# EAGLE design main (EAGLE 6.1)
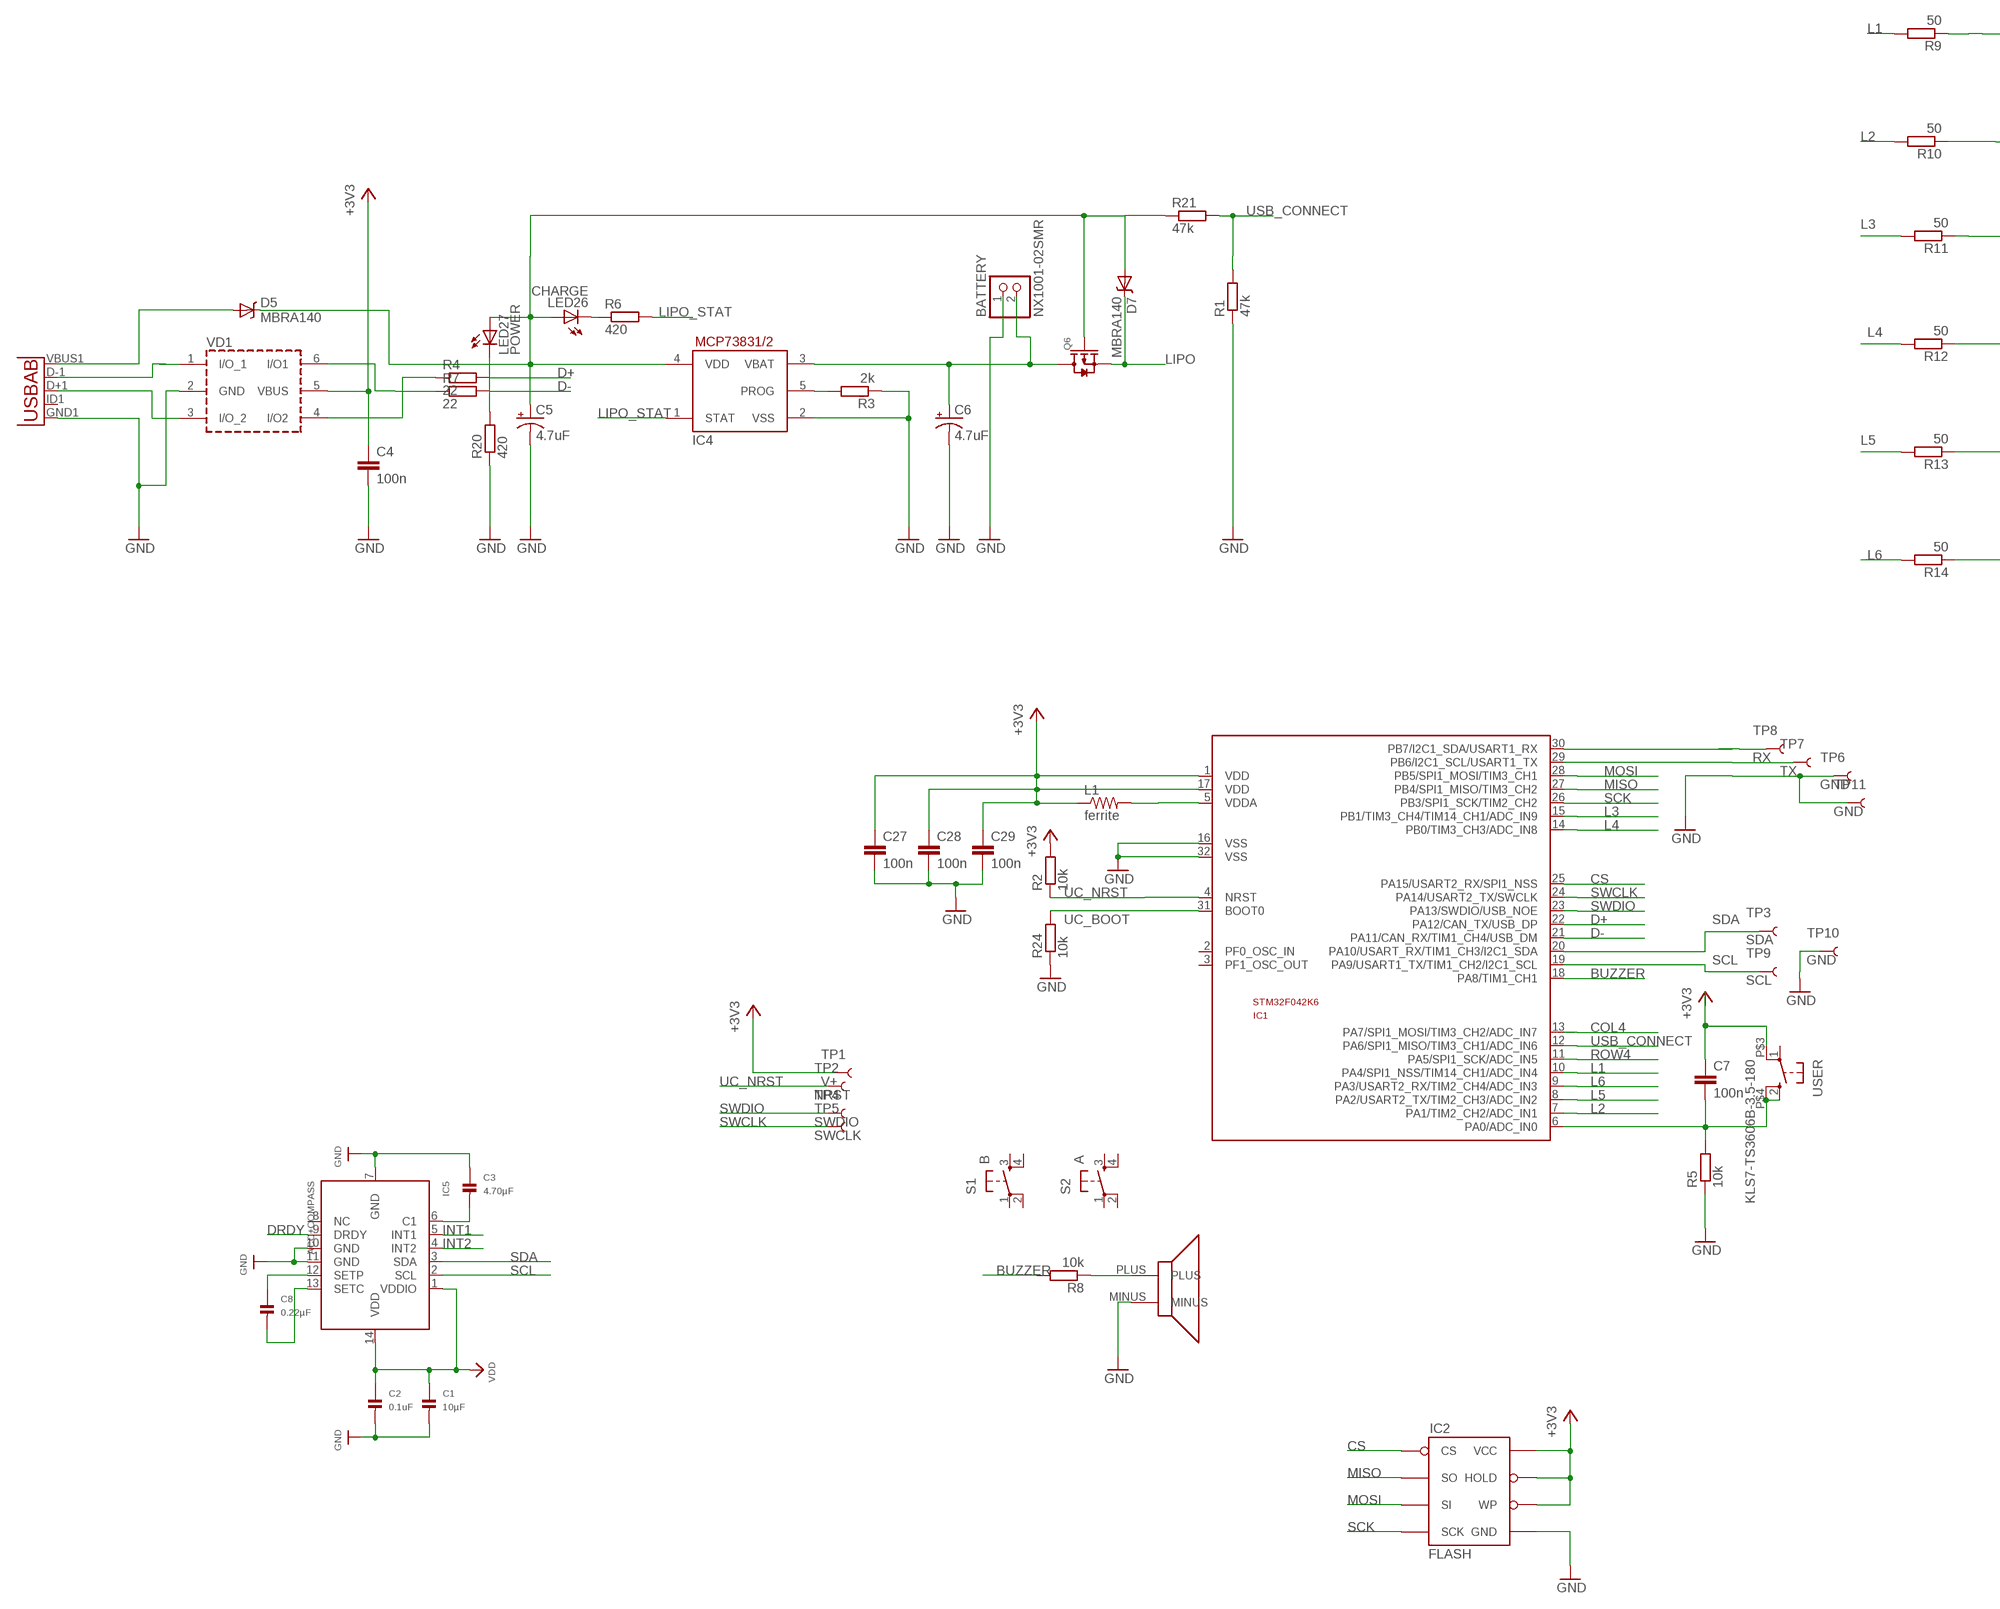
[diagram p0: schematic, sheet 1, part 1 of 2]
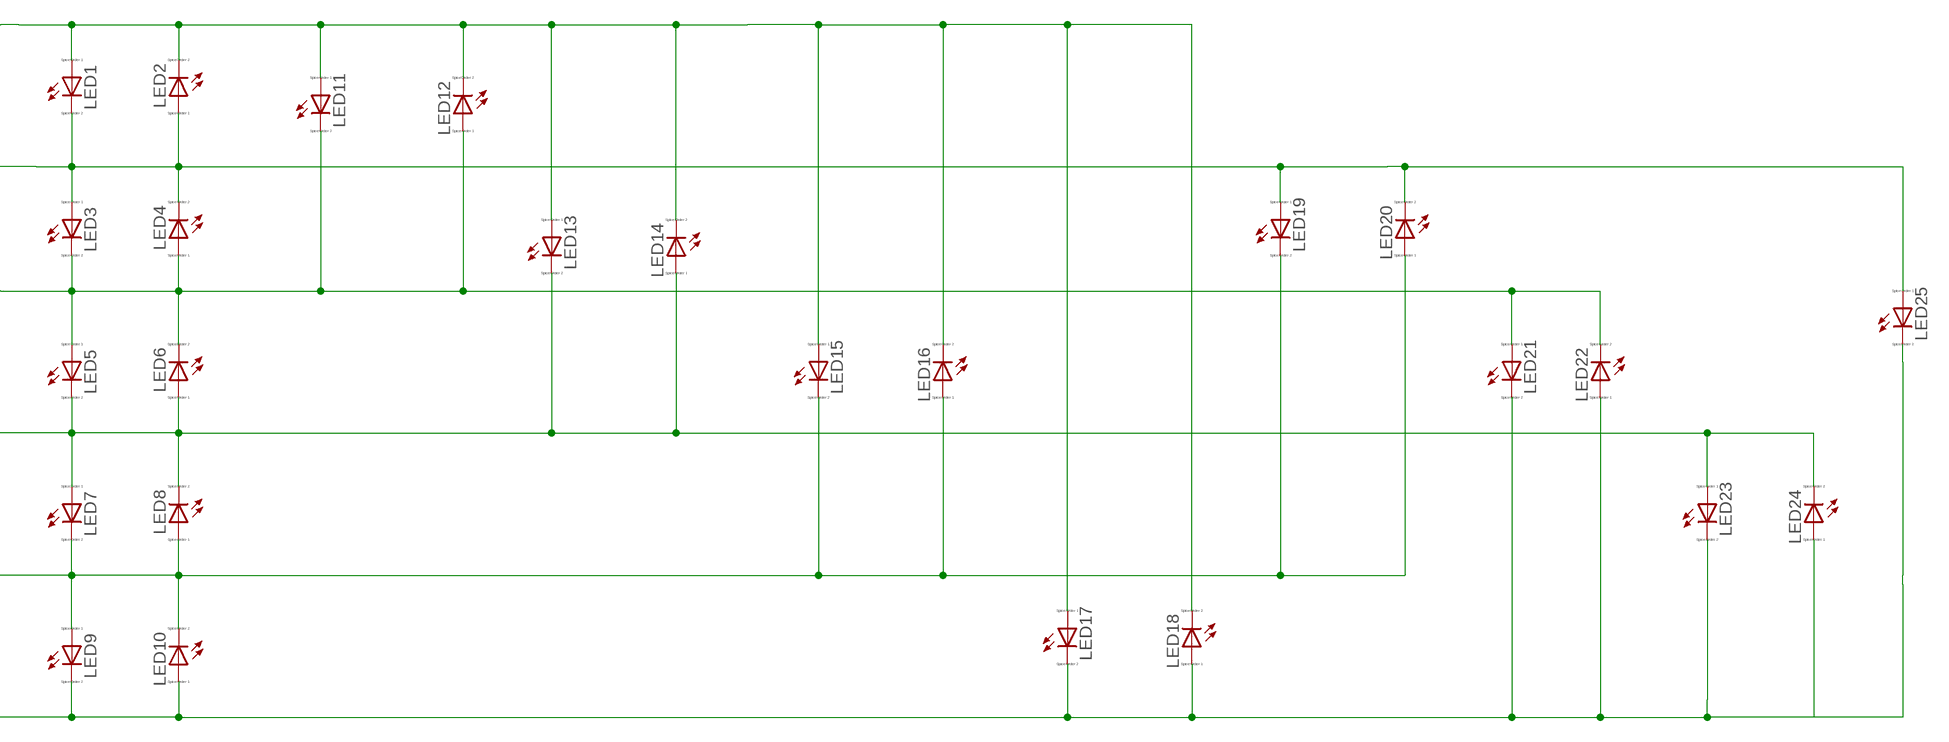
[diagram p1: schematic, sheet 1, part 2 of 2]

## Parts
BATTERY  NX1001-02SMR  [NX1001-02]
C1  10µF  CAP_CERAMIC_0805  [_0805]
C2  0.1uF  CAP_CERAMIC_0805  [_0805]
C3  4.70µF  CAP_CERAMIC_0805  [_0805]
C4  100n  C-EUC0603  [C0603]
C5  4.7uF  CAP_POL1206  [EIA3216]
C6  4.7uF  CAP_POL1206  [EIA3216]
C7  100n  C-EUC0603  [C0603]
C8  0.22µF  CAP_CERAMIC_0805  [_0805]
C27  100n  C-EUC0603  [C0603]
C28  100n  C-EUC0603  [C0603]
C29  100n  C-EUC0603  [C0603]
D5  MBRA140  [SMA-DIODE]
D7  MBRA140  [SMA-DIODE]
IC1  STM32F042K6  [LQFP32-7X7]
IC2  FLASH  AT25DF041A-SSH-T  [SO08]
IC4  MCP73831  MCP73831/OT  [SOT23-5L]
IC5  ACC+COMPASS  LSM303DLHC  [LGA14]
L1  ferrite  220-5%  [0603-RES]
LED1  LED_ESML0603  [LED_SML0603]
LED2  LED_ESML0603  [LED_SML0603]
LED3  LED_ESML0603  [LED_SML0603]
LED4  LED_ESML0603  [LED_SML0603]
LED5  LED_ESML0603  [LED_SML0603]
LED6  LED_ESML0603  [LED_SML0603]
LED7  LED_ESML0603  [LED_SML0603]
LED8  LED_ESML0603  [LED_SML0603]
LED9  LED_ESML0603  [LED_SML0603]
LED10  LED_ESML0603  [LED_SML0603]
LED11  LED_ESML0603  [LED_SML0603]
LED12  LED_ESML0603  [LED_SML0603]
LED13  LED_ESML0603  [LED_SML0603]
LED14  LED_ESML0603  [LED_SML0603]
LED15  LED_ESML0603  [LED_SML0603]
LED16  LED_ESML0603  [LED_SML0603]
LED17  LED_ESML0603  [LED_SML0603]
LED18  LED_ESML0603  [LED_SML0603]
LED19  LED_ESML0603  [LED_SML0603]
LED20  LED_ESML0603  [LED_SML0603]
LED21  LED_ESML0603  [LED_SML0603]
LED22  LED_ESML0603  [LED_SML0603]
LED23  LED_ESML0603  [LED_SML0603]
LED24  LED_ESML0603  [LED_SML0603]
LED25  LED_ESML0603  [LED_SML0603]
LED26  CHARGE  LEDCHIP-LED0805  [CHIP-LED0805]
LED27  POWER  LEDCHIP-LED0805  [CHIP-LED0805]
Q6  MOSFET-P-044021001  [SOT23]
R1  47k  R-EU_R0603  [R0603]
R2  10k  R-EU_R0603  [R0603]
R3  2k  R-EU_R0603  [R0603]
R4  22  R-EU_R0603  [R0603]
R5  10k  R-EU_R0603  [R0603]
R6  420  R-EU_R0603  [R0603]
R7  22  R-EU_R0603  [R0603]
R8  10k  R-EU_R0603  [R0603]
R9  50  R-EU_R0603  [R0603]
R10  50  R-EU_R0603  [R0603]
R11  50  R-EU_R0603  [R0603]
R12  50  R-EU_R0603  [R0603]
R13  50  R-EU_R0603  [R0603]
R14  50  R-EU_R0603  [R0603]
R20  420  R-EU_R0603  [R0603]
R21  47k  R-EU_R0603  [R0603]
R24  10k  R-EU_R0603  [R0603]
S1  B  DTSM-6  [DTSM-6]
S2  A  DTSM-6  [DTSM-6]
TP1  V+  TEST-POINT3X5  [PAD.03X.05]
TP2  NRST  TEST-POINT3X5  [PAD.03X.05]
TP3  SDA  TEST-POINT3X5  [PAD.03X.05]
TP4  SWDIO  TEST-POINT3X5  [PAD.03X.05]
TP5  SWCLK  TEST-POINT3X5  [PAD.03X.05]
TP6  GND  TEST-POINT3X5  [PAD.03X.05]
TP7  TX  TEST-POINT3X5  [PAD.03X.05]
TP8  RX  TEST-POINT3X5  [PAD.03X.05]
TP9  SCL  TEST-POINT3X5  [PAD.03X.05]
TP10  GND  TEST-POINT3X5  [PAD.03X.05]
TP11  GND  TEST-POINT3X5  [PAD.03X.05]
U2  USB""  [USB-MICRO-SMD]
U$1  SMD-090045F-03627  [SMD090045F]
USER  KLS7-TS3606B-3.5-180  [KLS7-TS3606B]
VD1  USBLC6-2SC6  [SOT-23-6L]

## Nets
+3V3: C4.1 C7.1 C27.1 C28.1 C29.1 IC1.1(VDD) IC1.17(VDD) IC2.3(WP) IC2.7(HOLD) IC2.8(VCC) L1.1 R2.2 TP1.P$1 USER.P$3 VD1.5(VBUS)
BBBB: BATTERY.2 C6.A(+) IC4.3(VBAT) Q6.3(D)
BUZZER: IC1.18(PA8/TIM1_CH1) R8.2
COL4: IC1.13(PA7/SPI1_MOSI/TIM3_CH2/ADC_IN7)
CS: IC1.25(PA15/USART2_RX/SPI1_NSS) IC2.1(CS)
D+: IC1.22(PA12/CAN_TX/USB_DP) R4.2
D-: IC1.21(PA11/CAN_RX/TIM1_CH4/USB_DM) R7.2
DRDY: IC5.9(DRDY)
GND: BATTERY.1 C1.2 C2.2 C3.1 C4.2 C5.C(-) C6.C(-) C27.2 C28.2 C29.2 IC1.16(VSS) IC1.32(VSS) IC2.4(GND) IC4.2(VSS) IC5.7(GND) IC5.10(GND) IC5.11(GND) R1.1 R3.1 R5.1 R20.1 R24.1 TP6.P$1 TP10.P$1 TP11.P$1 U2.GND1(GND) U$1.MINUS VD1.2(GND)
INT1: IC5.5(INT1)
INT2: IC5.4(INT2)
L1: IC1.10(PA4/SPI1_NSS/TIM14_CH1/ADC_IN4) R9.2
L2: IC1.7(PA1/TIM2_CH2/ADC_IN1) R10.2
L3: IC1.15(PB1/TIM3_CH4/TIM14_CH1/ADC_IN9) R11.2
L4: IC1.14(PB0/TIM3_CH3/ADC_IN8) R12.2
L5: IC1.8(PA2/USART2_TX/TIM2_CH3/ADC_IN2) R13.2
L6: IC1.9(PA3/USART2_RX/TIM2_CH4/ADC_IN3) R14.2
LIPO: D7.C Q6.2(S)
LIPO_STAT: IC4.1(STAT) R6.2
MISO: IC1.27(PB4/SPI1_MISO/TIM3_CH2) IC2.2(SO)
MOSI: IC1.28(PB5/SPI1_MOSI/TIM3_CH1) IC2.5(SI)
N$1: R8.1 U$1.PLUS
N$2: U2.D-1(D-) VD1.1(I/O_1)
N$3: U2.D+1(D+) VD1.3(I/O_2)
N$4: C3.2 IC5.6(C1)
N$5: C8.1 IC5.12(SETP)
N$6: C8.2 IC5.13(SETC)
N$7: IC4.5(PROG) R3.2
N$8: LED1.A LED2.C LED11.A LED12.C LED13.A LED14.C LED15.A LED16.C LED17.A LED18.C R9.1
N$9: LED1.C LED2.A LED3.A LED4.C LED19.A LED20.C LED25.A R10.1
N$12: LED3.C LED4.A LED5.A LED6.C LED11.C LED12.A LED21.A LED22.C R11.1
N$13: D5.A U2.VBUS1(VBUS)
N$14: IC1.29(PB6/I2C1_SCL/USART1_TX) TP7.P$1
N$15: IC1.5(VDDA) L1.2
N$16: R7.1 VD1.6(I/O1)
N$17: LED26.C R6.1
N$19: LED5.C LED6.A LED7.A LED8.C LED13.C LED14.A LED23.A LED24.C R12.1
N$21: R4.1 VD1.4(I/O2)
N$23: LED7.C LED8.A LED9.A LED10.C LED15.C LED16.A LED19.C LED20.A R13.1
N$24: LED27.C R20.2
N$26: LED9.C LED10.A LED17.C LED18.A LED21.C LED22.A LED23.C LED24.A LED25.C R14.1
N$27: C5.A(+) D5.C D7.A IC4.4(VDD) LED26.A LED27.A Q6.1(G) R21.1
ROW4: IC1.11(PA5/SPI1_SCK/ADC_IN5)
RX: IC1.30(PB7/I2C1_SDA/USART1_RX) TP8.P$1
SCK: IC1.26(PB3/SPI1_SCK/TIM2_CH2) IC2.6(SCK)
SCL: IC1.19(PA9/USART1_TX/TIM1_CH2/I2C1_SCL) IC5.2(SCL) TP9.P$1
SDA: IC1.20(PA10/USART_RX/TIM1_CH3/I2C1_SDA) IC5.3(SDA) TP3.P$1
SWCLK: IC1.24(PA14/USART2_TX/SWCLK) TP5.P$1
SWDIO: IC1.23(PA13/SWDIO/USB_NOE) TP4.P$1
UC_BOOT: IC1.31(BOOT0) R24.2
UC_NRST: IC1.4(NRST) R2.1 TP2.P$1
USB_CONNECT: IC1.12(PA6/SPI1_MISO/TIM3_CH1/ADC_IN6) R1.2 R21.2
VDD: C1.1 C2.1 IC5.1(VDDIO) IC5.14(VDD)
WAKE_UP: C7.2 IC1.6(PA0/ADC_IN0) R5.2 USER.2 USER.P$4
Unconnected: IC1.2(PF0_OSC_IN) IC1.3(PF1_OSC_OUT) IC5.8(NC) S1.1 S1.2 S1.3 S1.4 S2.1 S2.2 S2.3 S2.4 U2.ID1(USBID) USER.1

## Library data of the parts
BATTERY = connectors:NX1001-02SMR
C1-C3 C8 = microbuilder:CAP_CERAMIC: Ceramic Capacitors 0402 - 0402 Surface Mount Capacitors 16pF 50V 5% [Digikey: 445-4899-2-ND] 18pF 50V 5% [Digikey: 490-1281-2-ND] 22pF 50V 5% [Digikey: 490-1283-2-ND] 68pF 50V 5% [Digikey: 490-1289-2-ND] 0.1uF 10V 10% [Digikey: 490-1318-2-ND] 1.0uF 6.3V 10% [Digikey: 490-1320-2-ND] 0603 - 0603 Surface Mount Capacitors 16 pF 50V 5% [Digikey: 445-5051-2-ND] 22 pF 50V [Digikey: PCC220ACVTR-ND] 33 pF 50V 5% [Digikey: 490-1415-1-ND] 56pF 50V 5% [Digikey: 490-1421-1-ND] 220pF 50V 5% [Digikey: 445-1285-1-ND] 680 pF 50V 2200 pF 50V 5% C0G [Digikey: 445-1297-1-ND] 5600 pF 100V 5% X7R [Digikey: 478-3711-1-ND] 0.1 µF 25V 10% [Digikey: PCC2277TR-ND] 0.22 µF 16V 10% X7R [Digikey: 445-1318-1-ND] 1.0 µF 25V 10% [Digikey: 445-5146-2-ND] 0603 - RF Specific 3pF 250V +/-0.1pF RF [Digikey: 712-1347-1-ND] 18 pF 250V 5% [Digikey: 478-3505-1-ND or 712-1322-1-ND] 56 pF 250V 5% C0G RF [Digikey: 490-4867-1-ND] 68 pF 250V RF [Digikey: 490-4868-1-ND] 0805 - 0805 Surface Mount Capacitors 220 pF 250V 2% RF Ceramic Capacitor [Digikey: 712-1398-1-ND] 1000 pF 50V 2% NP0 Ceramic Capacitor [Digikey: 478-3760-1-ND] 0.1 µF 25V 10% Ceramic Capacitor [Digikey: PCC1828TR-ND] 1.0 µF 16V 10% Ceramic Capacitor[Digikey: 490-1691-2-ND] 10.0 µF 10V 10% Ceramic Capacitor[Digikey: 709-1228-1-ND] 10.0 uF 16V 10% Ceramic Capacitor [Digikey: 478-5165-2-ND] 47 uF 6.3V 20% Ceramic Capacitor [Digikey: 587-1779-1-ND or 399-5506-1-ND] 1206 - 1206 Surface Mount Capacitors 47uF 10V 20% Ceramic Capacitor [Digikey: 490-5528-1-ND or 399-5508-1-ND or 445-6010-1-ND] 100uF 6.3V -20%, +80% Y5V Ceramic Capacitor (Digikey: 490-4512-1-ND, Mouser: 81-GRM31CF50J107ZE1L)
C4 C7 C27-C29 = resistor:C-EU: CAPACITOR, European symbol
C5 C6 = SparkFun-Passives:CAP_POL: Capacitor Polarized These are standard SMD and PTH capacitors. Normally 10uF, 47uF, and 100uF in electrolytic and tantalum varieties. Always verify the external diameter of the through hole cap, it varies with capacity, voltage, and manufacturer. The EIA devices should be standard.
D5 D7 = SparkFun-DiscreteSemi:MBRA140: 40V, 1A Schottky rectifier SMA/DO-214AC package DIO-08053; PROD_ID: DIO-08053
IC1 = guh:STM32F042K6: STM32F042K6
IC2 = SparkFun-DigitalIC:AT25DF041A-SSH-T
IC4 = adafruit:MCP73831: MCP73831/2 Miniature Single-Cell, Fully Integrated Li-Ion, Li-Polymer Charge Management Controllers. Nice and small simple lipoly charge controller, with adjustable current and status output (LED) http://www.ladyada.net/library/pcb/eaglelibrary.html
IC5 = microbuilder:LSM303DLHC: LSM303DLHC 3-Axis I2C Accelerometer and 3-Axis Magnetometer VDD: 2.2-3.6V VDDIO: 1.8-VDD Magnetic Range: +/-1.3 to +/-8.1 gauss Accel Range: +/-2/4/8/16 g Temp: -40 - 85°C
L1 = SparkFun-Resistors:220-5%: 220-ohm SMT 1/8W - 5% (0805) RES-07866; PROD_ID: RES-07866; VALUE: 220
LED1-LED25 = eagle-ltspice:LED_E: LED Source: http://www.osram.convergy.de Source: www.luxeon.com Source: www.kingbright.com; SPICEMODEL: NONE; SPICEPREFIX: D; SPICETYPE: diode
LED26 LED27 = adafruit:LED: LED OSRAM: - CHIPLED LG R971, LG N971, LY N971, LG Q971, LY Q971, LO R971, LY R971 LH N974, LH R974 LS Q976, LO Q976, LY Q976 LO Q996 - Hyper CHIPLED LW Q18S LB Q993, LB Q99A, LB R99A - SideLED LS A670, LO A670, LY A670, LG A670, LP A670 LB A673, LV A673, LT A673, LW A673 LH A674 LY A675 LS A676, LA A676, LO A676, LY A676, LW A676 LS A679, LY A679, LG A679 - Hyper Micro SIDELED® LS Y876, LA Y876, LO Y876, LY Y876 LT Y87S - SmartLED LW L88C, LW L88S LB L89C, LB L89S, LG L890 LS L89K, LO L89K, LY L89K LS L896, LA L896, LO L896, LY L896 - TOPLED LS T670, LO T670, LY T670, LG T670, LP T670 LSG T670, LSP T670, LSY T670, LOP T670, LYG T670 LG T671, LOG T671, LSG T671 LB T673, LV T673, LT T673, LW T673 LH T674 LS T676, LA T676, LO T676, LY T676, LB T676, LH T676, LSB T676, LW T676 LB T67C, LV T67C, LT T67C, LS T67K, LO T67K, LY T67K, LW E67C LS E67B, LA E67B, LO E67B, LY E67B, LB E67C, LV E67C, LT E67C LW T67C LS T679, LY T679, LG T679 LS T770, LO T770, LY T770, LG T770, LP T770 LB T773, LV T773, LT T773, LW T773 LH T774 LS E675, LA E675, LY E675, LS T675 LS T776, LA T776, LO T776, LY T776, LB T776 LHGB T686 LT T68C, LB T68C - Hyper Mini TOPLED® LB M676 - Mini TOPLED Santana® LG M470 LS M47K, LO M47K, LY M47K Source: http://www.osram.convergy.de/
Q6 = OPL Eagle Library:MOSFET-P: CJ2305：SMD MOSFET P-CH 8V-4.1A
R1-R14 R20 R21 R24 = resistor:R-EU_: RESISTOR, European symbol
S1 S2 = switch-tact:DTSM-6
TP1-TP11 = SparkFun-Passives:TEST-POINT: Bare copper test points for troubleshooting or ICT
U2 = MicroUSB:USB: This is a USB AB connector that is compatible with USB OTG. i.e. this connector can serve as a host or device
U$1 = Elements:SMD-090045F-03627
USER = connectors:KLS7-TS3606B-3.5-180
VD1 = usblc6:USBLC6-2: VERY LOW CAPACITANCE ESD PROTECTION 2 line Datasheet link <http://www.st.com/web/catalog/sense_power/FM114/CL1137/SC1489/PF93353>

## Net classes
2 gnd: width 0.305 mm, drill 0.559 mm, clearance 0.254 mm

## Board
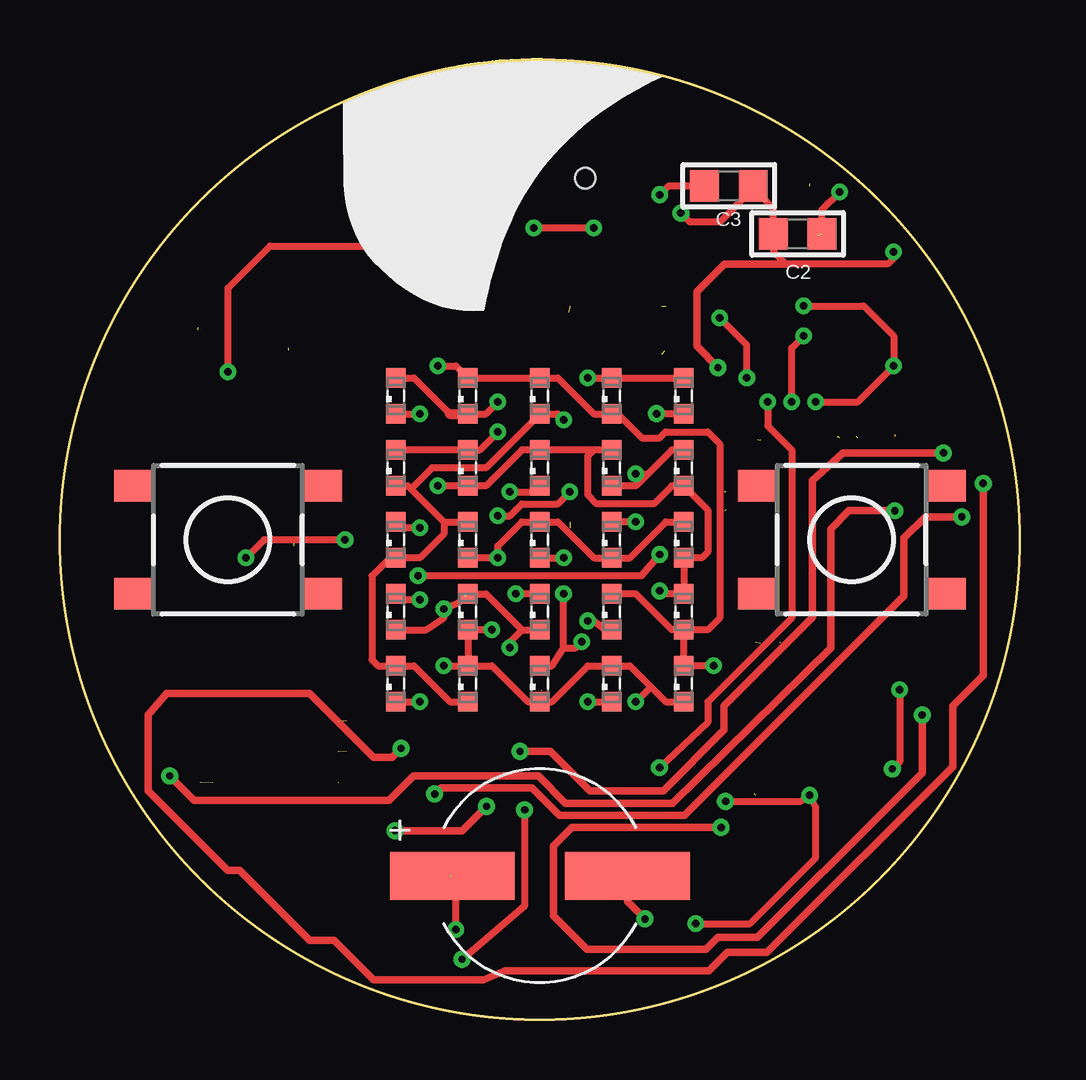
[diagram p2: board, top side]
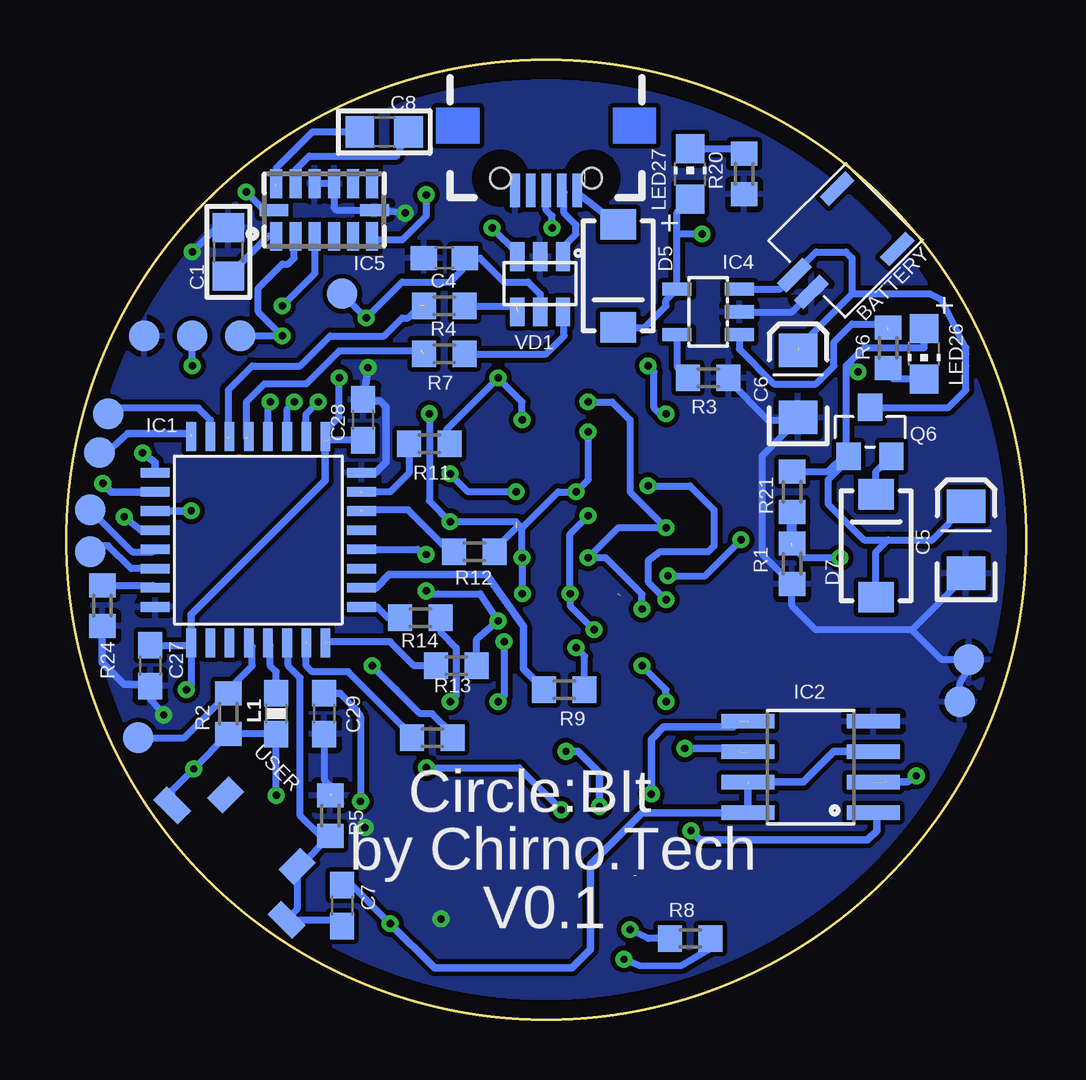
[diagram p3: board, bottom side, seen from below]

Size 40 x 40 mm. Coordinates in mm from the lower left corner, seen from the top.
Outline: circle at 20,20 radius 20
Copper layers (1*16): Top 0.035mm / dielectric 1.5mm / Bottom 0.035mm
Design rules: minimum track width 0.2mm, minimum drill 0.3mm, track to track 0.2mm, track to pad 0.2mm, pad to pad 0.2mm, via to via 0.2mm, smd to smd 8mil, copper to edge 30mil, drill to drill 8mil, minimum pad ring 10mil, minimum via ring 8mil, stop-mask expansion 4mil, vias tented up to drill 0.4mm, thermal gap 10mil

### Footprints (pad centres in the part's own frame; a part is rotated, then mirrored left to right if it is on the bottom)
NX1001-02 = smd 0.55 x 1.5: 1 -0.508,0.25; 2 0.492,0.25; P$3 -1.778,-3.56; P$4 1.778,-3.56
_0805 = smd 1.2 x 1.3: 1 -1.016,0; 2 1.016,0
C0603 = smd 1.1 x 1: 1 -0.85,0; 2 0.85,0
EIA3216 = smd 1.4 x 1.6: A 1.4,0; C -1.4,0
SMA-DIODE = smd 1.27 x 1.47: A -2.15,0; C 2.15,0
LQFP32-7X7 = smd 1.2 x 0.4: 1 -4.3,2.8; 2 -4.3,2; 3 -4.3,1.2; 4 -4.3,0.4; 5 -4.3,-0.4; 6 -4.3,-1.2; 7 -4.3,-2; 8 -4.3,-2.8; 17 4.3,-2.8; 18 4.3,-2; 19 4.3,-1.2; 20 4.3,-0.4; 21 4.3,0.4; 22 4.3,1.2; 23 4.3,2; 24 4.3,2.8 | smd 0.4 x 1.2: 9 -2.8,-4.3; 10 -2,-4.3; 11 -1.2,-4.3; 12 -0.4,-4.3; 13 0.4,-4.3; 14 1.2,-4.3; 15 2,-4.3; 16 2.8,-4.3; 25 2.8,4.3; 26 2,4.3; 27 1.2,4.3; 28 0.4,4.3; 29 -0.4,4.3; 30 -1.2,4.3; 31 -2,4.3; 32 -2.8,4.3
SO08 = smd 0.61 x 2.21: 1 -1.905,-2.616; 2 -0.635,-2.616; 3 0.635,-2.616; 4 1.905,-2.616; 5 1.905,2.616; 6 0.635,2.616; 7 -0.635,2.616; 8 -1.905,2.616
SOT23-5L = smd 0.55 x 1.2: 1 -0.95,-1.3; 2 0,-1.3; 3 0.95,-1.3; 4 0.95,1.3; 5 -0.95,1.3
LGA14 = smd 0.5 x 1.2: 1 2,1.1; 2 1.2,1.1; 3 0.4,1.1; 4 -0.4,1.1; 5 -1.2,1.1; 6 -2,1.1; 8 -2,-1.1; 9 -1.2,-1.1; 10 -0.4,-1.1; 11 0.4,-1.1; 12 1.2,-1.1; 13 2,-1.1 | smd 1.2 x 0.5: 7 -2.1,0; 14 2.1,0
0603-RES = smd 1.1 x 1: 1 -0.85,0; 2 0.85,0
LED_SML0603 = smd 0.8 x 0.8: A 0.75,0; C -0.75,0
CHIP-LED0805 = smd 1.2 x 1.2: A 0,-1.05; C 0,1.05
SOT23 = smd 1.016 x 1.143: 1 -0.889,-1.016; 2 0.889,-1.016; 3 0,1.016
R0603 = smd 1 x 1.1: 1 -0.85,0; 2 0.85,0
DTSM-6 = smd 1.55 x 1.3: 1 -3.975,2.25; 2 3.975,2.25; 3 -3.975,-2.25; 4 3.975,-2.25
PAD.03X.05 = smd 1.27 x 1.27: P$1 0,0
USB-MICRO-SMD = smd 1.4 x 0.4: D+1 2.7,0; D-1 2.7,0.65; GND1 2.7,-1.3; ID1 2.7,-0.65; VBUS1 2.7,1.3 | hole 0.85: 2.2,1.9; 2.2,-1.9
SMD090045F = smd 5.2 x 2: MINUS 3.65,0; PLUS -3.65,0
KLS7-TS3606B = smd 0.9 x 1.27: 1 -2.1,0.885; 2 2.1,0.885 | smd 1.45 x 0.8: P$3 -3.375,-1; P$4 3.375,-1
SOT-23-6L = smd 0.6 x 1.2: 1 -0.95,-2.3; 2 0,-2.3; 3 0.95,-2.3; 4 0.95,0; 5 0,0; 6 -0.95,0

### Placement (x,y rotation side)
BATTERY  9.13,30.87 135 bottom
C1  33.25,32 90 bottom
C2  30.75,32.75 180 top
C3  27.88,34.75 180 top
C4  24.25,31.75 180 bottom
C5  2.5,20 90 bottom
C6  9.5,26.5 90 bottom
C7  28.5,4.75 270 bottom
C8  26.75,37 180 bottom
C27  36.5,14.75 270 bottom
C28  27.63,25 90 bottom
C29  29.25,12.75 270 bottom
D5  17,31 270 bottom
D7  6.25,19.75 90 bottom
IC1  32,20 90 bottom
IC2  8.97,10.53 90 bottom
IC4  13.25,29.5 90 bottom
IC5  29.25,33.75 180 bottom
L1  31.25,12.75 90 bottom
LED1  14,26 90 top
LED2  17,26 90 top
LED3  20,26 90 top
LED4  23,26 90 top
LED5  26,26 90 top
LED6  14,23 90 top
LED7  17,23 90 top
LED8  20,23 90 top
LED9  23,23 90 top
LED10  26,23 90 top
LED11  14,20 90 top
LED12  17,20 90 top
LED13  20,20 90 top
LED14  23,20 90 top
LED15  26,20 90 top
LED16  14,17 90 top
LED17  17,17 90 top
LED18  20,17 90 top
LED19  23,17 90 top
LED20  26,17 90 top
LED21  14,14 90 top
LED22  17,14 90 top
LED23  20,14 90 top
LED24  23,14 90 top
LED25  26,14 90 top
LED26  4.25,27.75 180 bottom
LED27  14,35.25 0 bottom
Q6  6.5,24.5 0 bottom
R1  9.75,19 90 bottom
R2  33.25,12.75 270 bottom
R3  13.25,26.75 180 bottom
R4  24.25,29.75 180 bottom
R5  29,8.5 270 bottom
R6  5.75,28 90 bottom
R7  24.25,27.75 180 bottom
R8  14,3.38 0 bottom
R9  19.25,13.75 180 bottom
R10  24.75,11.75 180 bottom
R11  24.87,24 180 bottom
R12  23,19.5 180 bottom
R13  23.75,14.75 180 bottom
R14  25.25,16.75 180 bottom
R20  11.75,35.25 90 bottom
R21  9.75,22 270 bottom
R24  38.5,17.25 90 bottom
S1  33,20 0 top
S2  7,20 0 top
TP1  28.5,30.25 0 bottom
TP2  37,11.75 0 bottom
TP3  34.75,28.5 0 bottom
TP4  38.25,25.25 0 bottom
TP5  38.62,23.63 0 bottom
TP6  2.38,15 0 bottom
TP7  39,21.25 0 bottom
TP8  39,19.5 0 bottom
TP9  32.75,28.5 0 bottom
TP10  36.75,28.5 0 bottom
TP11  2.75,13.25 0 bottom
U2  20,37.27 270 bottom
U$1  20,6 0 top
USER  32.5,7.25 315 bottom
VD1  20.25,29.5 180 bottom

### Tracks (layer width: path | path; a pad name or v marks a point on that pad's centre or on a via)
+3V3  (via drill 0.3)  (2 unrouted)
  Top 0.3: v35,13.75 35,10.75 v34.7,10.45 | v28.63,26.75 28.63,28.12 v27.5,29.25 | v26.5,4 28.75,4 31.5,6.75 31.5,8.85 v31.25,9.35 30.87,9.1 v27.75,9.1
  Bottom 0.3: C28.1 29.1,24.15 29.25,24.25 29.25,24.5 28.63,25.12 v28.63,26.75 | C27.1 34.9,15.6 IC1.1 34.8,13.95 v35,13.75 | USER.P$3 35.59,9.56 34.83,10.32 v34.7,10.45 R2.2 L1.1 | TP1.P$1 v27.5,29.25 26,30.75 24,30.75 23.5,31.25 23.5,31.65 C4.1 22.75,31.75 21.75,30.75 20.75,30.75 20.25,30.25 VD1.5 | C7.1 28.1,5.6 v26.5,4 | v31.25,9.35 L1.1 | L1.1 31.25,12 | C29.1 28.9,13.6 28.6,13.6 28,13 27.75,12.64 v27.75,9.1
  Bottom 0.305: 29.1,24.15 IC1.17 | 34.83,10.32 v34.7,10.45 | C29.1 28.9,13.6 | 28.9,13.6 28.6,13.6 28.9,13.6 | IC1.1 34.8,16.89 29.21,22.48 29.21,24.13 | v26.5,4 24.66,2.16 18.92,2.16 18.16,2.92 18.16,6.48 16.02,8.62 IC2.8 11.59,9.88 11.56,9.91 9.27,9.91 8,11.18 6.37,11.18 IC2.3
BBBB  (1 unrouted)
  Bottom 0.3: IC4.3 10.25,30.45 BATTERY.2 9.66,31.09 8.75,32 7.5,32 7.25,31.75 7.25,30.25 | Q6.3 3.23,25.52 2.5,26.25 2.5,27.25 2.5,27.75 2.5,28 3.5,30 4,30.25 7.25,30.25 | 7.25,30.25 8.25,29.25 9.5,28
BUZZER  (via drill 0.3)
  Top 0.3: v29.5,25.75 29.5,24.75 30.5,23.75 30.5,16.75 27,13.25 27,12.38 v25,10.5 | v19.37,8.74 19.37,4.75 v16.76,2.52
  Bottom 0.3: IC1.18 30,25.25 v29.5,25.75 | v25,10.5 21.13,10.5 v19.37,8.74 | v16.76,2.52 16.16,2.26 14.39,2.25 13.25,2.9 R8.2
CS  (via drill 0.3)
  Top 0.305: v36.83,23.62 32.64,23.62 31.37,22.48 31.37,16.76 27.69,13.08 27.69,12.06 25.15,9.53 22.1,9.53 20.45,11.18 v19.18,11.18 | v13.97,7.87 16.76,7.87 v17.78,8.89
  Bottom 0.305: IC1.25 36.3,23.22 v36.83,23.62 | IC2.1 6.22,8.49 6.22,7.87 6.6,7.49 13.59,7.49 v13.97,7.87 | v17.78,8.89 17.78,10.29 18.67,11.18 v19.18,11.18
D+  (2 unrouted)
  Bottom 0.3: 33.25,24.25 33.25,25.25 33.25,26.25 32.25,27.25 30.25,27.25 29,28.5 26.75,28.5 26,29.25 25.75,29.25 25.25,29.75
D-  (2 unrouted)
  Bottom 0.3: 32.5,24.25 32.5,24.5 32.5,25.75 31.75,26.5 30,26.5 28.62,27.88 25.21,27.88 25.15,27.94
GND  (via drill 0.3)  (1 unrouted)
  Top 0.3: v34.75,32 34.75,31.75 34.5,31.5 30.25,31.5 29.75,32 29.75,32.73 C2.2 29.73,33.78 C3.1 28.77,34.52 27.5,33.25 26.25,33.25 v25.88,33.62
  Top 0.305: U$1.MINUS 23.65,4.92 v24.38,4.19 | v35.94,12.7 35.94,10.29 34.54,8.89 29.08,3.43 27.43,3.43 26.92,2.92 21.97,2.92 20.57,4.32 20.57,7.24 21.34,8 26.67,8 v27.56,8 | 30.25,31.5 27.69,31.5 26.54,30.35 26.54,28.07 v27.43,27.18
  Bottom 0.3: IC5.11 IC5.10 28.85,33.85 28.75,33.75 IC5.7 | C1.2 33.73,33.02 v34.75,32 | v25.88,33.62 27.13,33.75 | IC4.2 9.75,29.5 9,30.25 | R3.1 12.4,26.65 10.75,25 9.6,25 C6.C 9.5,25 11,23.5 11,19.4 R1.1 9.75,17.25 8.75,16.25 4.75,16.25 | C5.C 2.5,18.5 4.75,16.25 | TP11.P$1 2.75,14 2.26,14.87 TP6.P$1 3.5,15 4.75,16.25 | C29.2 29.25,10 29,9.75 | 27.65,22.75 IC1.16
  Bottom 0.305: v24.38,4.19 24.38,4.06 | R24.1 38.5,14.88 37.59,13.97 36.58,13.97 | IC1.16 27.11,22.8 26.67,23.24 26.67,25.53 26.92,25.78 27.43,25.78 C28.2 | C27.2 36.5,13.39 v35.94,12.7 | 28.57,9.02 28.96,9.4 | v27.43,27.18 27.56,26.29
  pour Bottom: -1.27,40.39 -1.65,-2.29 42.55,-2.29 42.55,39.62 -1.27,39.62
L1  (1 unrouted)
  Bottom 0.305: IC1.10 27.09,18 26.54,18.54 22.48,18.54 20.95,16.38 20.95,14.61 20.07,13.72
L2  (1 unrouted)
  Bottom 0.3: R10.2 26,12.25 28.25,14.5 29.75,14.5 30,14.75 30,15.75
L3  (1 unrouted)
  Bottom 0.3: R11.2 25.72,22.78 26.5,22 27.75,22
L4  (1 unrouted)
  Bottom 0.3: R12.2 24,19.5 25.75,21.25 27.75,21.25
L5  (1 unrouted)
  Bottom 0.3: R13.2 25.5,14.75 26.5,15.75 29,15.75
L6
  Bottom 0.3: IC1.9 27.05,17.2 26.6,16.75 R14.2
LIPO
  Bottom 0.3: D7.C 6.25,22.84 Q6.2
LIPO_STAT  (1 unrouted)
  Bottom 0.3: IC4.1 11.95,27.95 10.5,26.5 8.75,26.5 8,27.25 8,28.25 7.25,29 6,29 5.75,28.75
MISO  (via drill 0.3)  (1 unrouted)
  Top 0.305: v34.8,21.21 32.89,21.21 32.13,20.45 32.13,15.49 25.53,9.02 21.08,9.02 19.94,10.16 14.73,10.16 13.72,9.14 5.59,9.14 v4.57,10.16
  Bottom 0.305: IC1.27 v34.81,21.2 v34.8,21.21 | v4.57,10.16 4.95,9.91 5.08,9.91 5.84,9.91
MOSI  (via drill 0.3)  (1 unrouted)
  Top 0.305: v37.59,20.95 36.07,20.95 35.18,20.07 35.18,17.65 26.8,9.27 26.04,8.51 20.83,8.51 19.68,9.65 15.88,9.65 v15.62,9.4
  Bottom 0.305: IC1.28 36.91,20.4 v37.59,20.95 | v15.62,9.4 15.62,11.68 15.11,12.19 12.19,12.19 11.94,12.45
N$1  (via drill 0.3)  (1 unrouted)
  Top 0.3: v16.5,3.75 16.5,5.75 16.25,6
  Bottom 0.3: R8.1 15.75,3.38 v16.5,3.75
N$2
  Bottom 0.3: VD1.1 19.3,32.2 18.75,32.75 18.75,33.12 19.25,33.62 19.25,34.47 U2.D-1
N$3  (via drill 0.3)
  Top 0.3: v22.25,33 v19.75,33
  Bottom 0.3: v19.75,33 19.75,33.5 20,33.75 U2.D+1 | VD1.3 21.2,31.95 v22.25,33
N$4  (via drill 0.3)
  Top 0.3: C3.2 25.37,34.75 v25,34.38
  Bottom 0.3: v25,34.38 25,33.5 26,32.5 27.1,32.5 IC5.6
N$5
  Bottom 0.3: IC5.12 30.45,35.43 29.88,36 26.23,36 C8.1
N$6  (1 unrouted)
  Bottom 0.3: C8.2 29.75,37 31.25,35.5 31.25,34.75
N$7
  Bottom 0.3: IC4.5 14.55,27.2 R3.2
N$8  (via drill 0.3)  (1 unrouted)
  Top 0.3: LED1.A 14.75,26.75 16.25,25.25 17.75,25.25 v18.25,25.75 | v15,20.5 14.25,20.5 LED11.A | LED12.C v18.25,19.25 18.25,19.75 19.25,20.75 LED13.A 20.75,20.75 22.25,19.25 LED14.C 23.75,19.25 25.25,20.75 LED15.A | LED16.C 14.25,16.25 LED16.C | LED17.A 17.75,17.75 19.25,16.25 | 19.25,16.25 LED18.C | LED16.C 15.25,16.25 16,16.75 v16,17.11 16.61,17.37 16.89,17.65 | v18.75,15.5 18.75,15.75 19.25,16.25
  Top 0.406: 16.25,25.25 LED2.C
  Bottom 0.3: v18.25,25.75 17.25,25.75 16.5,25 16.5,22 v15,20.5 17,20.5 v18.25,19.25 17.51,19.25 16,17.73 v16,17.11 | R9.1 18.4,15.15 v18.75,15.5
N$9  (via drill 0.3)
  Top 0.3: LED1.C v15,25.25 | v15.75,27.25 16.5,27.25 LED2.A LED3.A 20.75,26.75 22.25,25.25 LED4.C 23.25,25.25 24.25,24.25 25,24.25 25.25,24.5 27,24.5 27.5,24 27.5,16.75 27,16.25 LED20.C | LED20.C 25.5,16.25 24,17.75 LED19.A | LED20.C LED25.A v27.25,14.75
  Bottom 0.3: v15,25.25 15.25,25.25 15.5,25.5 15.5,27 v15.75,27.25 | v27.25,14.75 26.25,13.75 25.25,12.75 24.75,12.75 23.9,11.9 R10.1
N$12  (via drill 0.3)
  Top 0.3: LED5.A LED4.A v22,26.75 | LED6.C 14.5,22.25 14.62,22.12 | 14.62,22.12 16,20.75 | 16,20.75 LED12.A | 16,20.75 16,20.25 15,19.25 LED11.C 13.75,19.25 13,18.5 13,15 13.25,14.75 LED21.A 14.75,14.75 16.25,13.25 LED22.C | v21,25 20.75,25.25 LED3.C 17.75,23 15.5,23 14.62,22.12
  Bottom 0.3: v21,25 21,25.75 v22,26.75 24.15,24.6 R11.1
N$13
  Bottom 0.3: U2.VBUS1 18.67,34.44 D5.A
N$14
  Bottom 0.3: TP7.P$1 37.25,19.5 36.4,19.5 IC1.29
N$15
  Bottom 0.3: L1.2 31.25,14.5 31.5,14.75 31.5,15.6 IC1.5
N$16
  Bottom 0.3: R7.1 20,27.75 19.25,28.5 19.25,29.45 VD1.6
N$17
  Bottom 0.3: LED26.C 5.55,26.7 R6.1
N$19  (via drill 0.3)  (1 unrouted)
  Top 0.3: LED6.A LED7.A 17.5,23.75 v18.25,24.5 | v18.75,22 19.75,22 LED8.C | LED5.C 25.25,25.25 v24.87,25.25 | v24,20.75 23.75,20.75 LED14.A | LED13.C v21,19.25 | LED23.A 20.5,14.75 21,15.5 | 21,15.5 v21,17.75 | 21,15.5 21.5,15.5 v21.75,15.75 | v22,13.25 LED24.C
  Bottom 0.3: v18.25,24.5 18.25,22.5 v18.75,22 19.5,22 21,20.5 | v24.87,25.25 24.87,21.62 v24,20.75 22.25,20.75 21.25,20.75 21,20.5 | 21,20.5 v21,19.25 21,19 v21,17.75 | v21.75,15.75 21.75,13.5 v22,13.25 | R12.1 22.15,19.6 21.25,20.5
N$21  (1 unrouted)
  Bottom 0.3: R4.1 21.25,29.75
N$23  (via drill 0.3)
  Top 0.3: LED9.A 22.25,23.75 | 22.25,23.75 LED8.A 19.25,23.75 18,22.5 17.75,22.25 LED7.C v15.75,22.25 | 22.25,23.75 22,23.5 22,21.87 22.37,21.5 24.75,21.5 25.5,22.25 LED10.C 27,21.25 27,19.5 26.75,19.25 LED15.C LED20.A 25.25,17.75 v25,17.87 | v15,17.5 14.25,17.5 LED16.A | v22,16.62 22.25,16.62 22.75,16.25 LED19.C
  Bottom 0.3: v15.75,22.25 14,22.25 13,21.25 13,19.75 13.25,19.5 15.25,19.5 15.75,19.12 15.75,18.25 v15,17.5 | v25,17.87 24.75,17.75 24.5,17.75 22.75,17.75 v22,16.62 22.9,15.85 R13.1
N$24
  Bottom 0.3: LED27.C 11.95,36.3 R20.2
N$26  (via drill 0.3)
  Top 0.3: LED22.A 18,14.75 19.5,13.25 LED23.C 20.5,13.25 22,14.75 LED24.A 23.75,14.75 24.62,13.88 | 24.62,13.88 25.25,13.25 LED25.C | LED10.A 25.5,23.75 24.5,22.75 | 24.5,22.75 24,22.25 LED9.C | LED18.A v19,17.75 | v18.25,21 18.75,21 19,21.25 19.25,21.5 20.75,21.5 v21.25,22 | v24,22.75 24.25,22.75 24.5,22.75 | v18,16.25 LED17.C LED22.A | LED21.C v15,13.25 | v16,14.75 LED22.A | v24,13.25 24.62,13.88
  Bottom 0.3: v18.25,21 19,20.25 v19,17.75 19,17.25 v18,16.25 | v21.25,22 23.25,22 v24,22.75 | v15,13.25 15,13.75 v16,14.75 | R14.1 24.4,16.15 23.75,15.5 23.75,13.5 v24,13.25
N$27  (via drill 0.3)
  Top 0.3: v7,27 7,30.5 8.75,32.25 13,32.25 v13.5,32.75
  Bottom 0.3: D5.C 15.9,28.85 15,29.75 15,30 IC4.4 14.55,32.75 | 14.55,32.75 14.55,33.65 LED27.A | LED26.A 4.25,28 6.75,28 7.5,27.25 | 7.5,27.25 7.5,23.5 7.6,23.5 8.25,22.85 | R21.1 8.25,22.85 | 8.25,22.85 8.02,22.85 Q6.1 7.39,23.36 8.25,22.5 8.25,21.5 6.75,20 5.75,20 | 5.75,20 3.9,20 C5.A | D7.A 6.25,19.5 5.75,20 | 7.5,27.25 7.25,27.25 v7,27 | v13.5,32.75 14.55,32.75
RX
  Bottom 0.3: IC1.30 37.3,18.8 38.25,19.75 38.75,19.75 TP8.P$1
SCK  (via drill 0.3)  (1 unrouted)
  Top 0.305: v38.48,22.35 38.48,14.35 37.21,13.08 37.21,10.54 29.72,3.05 29.46,2.79 27.81,2.79 27.05,2.03 18.54,2.03 17.65,1.65 15.75,1.65 15.37,1.65 13.08,1.65 11.43,3.3 10.41,3.3 7.49,6.22 6.99,6.22 3.68,9.53 3.68,12.7 4.45,13.59 10.41,13.59 13.08,10.92 13.84,10.92 v14.22,11.3
  Bottom 0.305: IC1.26 38.13,22 v38.48,22.35 | v14.22,11.3 12.06,11.3 11.94,11.18
SCL  (via drill 0.3)
  Top 0.3: v30.5,25.75 30.5,28 v31,28.5
  Bottom 0.3: IC1.19 30.8,25.45 v30.5,25.75 | TP9.P$1 v31,28.5 32,29.5 32,30.5 31,31.5 30.75,31.5 30.5,31.75 30.5,32.6 IC5.2
SDA  (via drill 0.3)
  Top 0.3: v31.5,25.75 33.25,25.75 v34.75,27.25 TP3.P$1 33.5,29.75 v31,29.75
  Bottom 0.3: IC1.20 31.6,25.65 v31.5,25.75 | v34.75,27.25 TP3.P$1 | IC5.3 29.65,31.1 v31,29.75
SWCLK  (1 unrouted)
  Bottom 0.3: 37.45,24.43 38.75,23.25 TP5.P$1
  Bottom 0.305: 37.45,24.43 34.84,24.43 34.8,24.38
SWDIO
  Bottom 0.3: IC1.23 34,25 34.5,25.5 38,25.5 TP4.P$1
UC_BOOT
  Bottom 0.3: R24.2 36.4,18.1 IC1.31
UC_NRST
  Bottom 0.3: TP2.P$1 35.1,11.75 R2.1 33.25,13.75 32.25,14.75 32.25,15.55 IC1.4
USB_CONNECT  (via drill 0.3)  (1 unrouted)
  Top 0.3: v11.88,20 8.5,20 v7.75,19.25 | v25,19.38 24.25,18.5 v14.93,18.5
  Bottom 0.3: IC1.12 25.35,19.6 v25,19.38 | v14.93,18.5 13.38,18.5 v11.88,20 | v7.75,19.25 9.25,19.25 9.75,19.75
  Bottom 0.406: 9.75,19.75 R21.2
VDD  (via drill 0.3)  (1 unrouted)
  Top 0.3: C2.1 31.77,33.77 v32.5,34.5
  Bottom 0.3: IC5.1 31.58,32.65 C1.1 | v32.5,34.5 32,34 31.75,33.75 IC5.14
WAKE_UP
  Bottom 0.3: C7.2 28.76,4.16 USER.P$4 30.39,4.59 USER.2 30.26,6.39 R5.2 29.4,7.65 30.25,8.5 30.25,14.25 30.75,14.75 30.75,15.65 IC1.6

### Text on the board
bPlace: Circle:BIt | by Chirno.Tech | V0.1